# Altium schematic sheet Input Filter.SchDoc
size A4
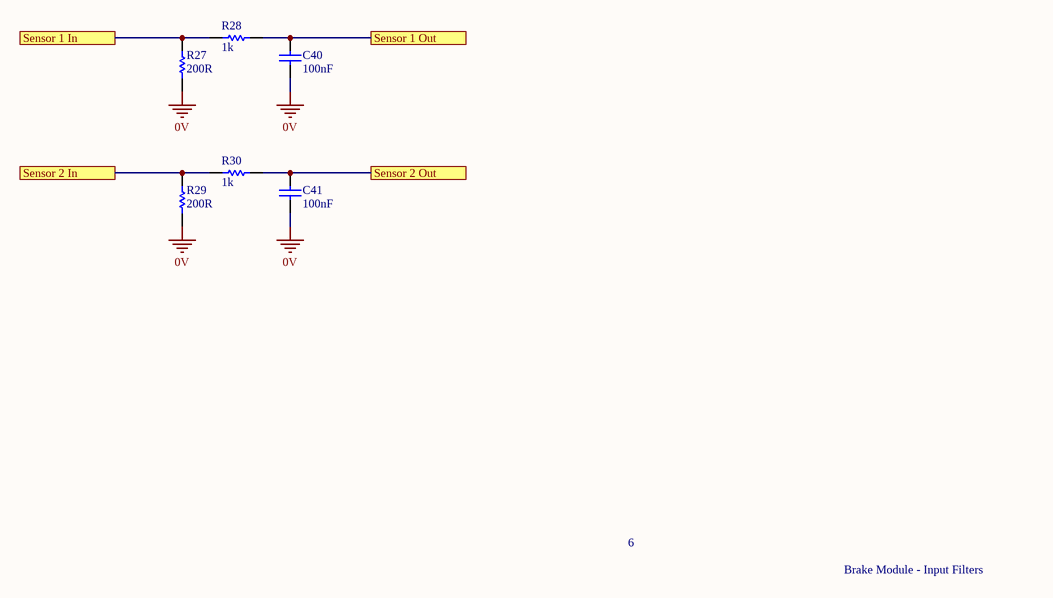
[diagram p0: Input Filter.SchDoc]

## Parts
C40  100nF  [0805]
C41  100nF  [0805]
R27  200R  [0805]
R28  1k  [0805]
R29  200R  [0805]
R30  1k  [0805]

## Ports
Sensor 1 In, Sensor 1 Out, Sensor 2 In, Sensor 2 Out

## Nets
0V: C40.1 C41.1 R27.1 R29.1
Sensor 1 In: R27.2 R28.1 ; port Sensor 1 In
Sensor 1 Out: C40.2 R28.2 ; port Sensor 1 Out
Sensor 2 In: R29.2 R30.1 ; port Sensor 2 In
Sensor 2 Out: C41.2 R30.2 ; port Sensor 2 Out

## Notes on the sheet
- 6
- Brake Module - Input Filters

## Library data of the parts
C40 C41 = GCM21BR71H104KA37L: Manufacturer: muRata; Tolerance: ±10%; Material: X7R; Rated Voltage: 50V; Part Number: GCM21BR71H104KA37L; Value: 100nF; Digikey Part Number: 490-6064-1-ND
R27 R29 = RC0805FR07200RL: Manufacturer: YAGEO; Tolerance: 0.01; Rated Voltage: 0.125W; Part Number: RC0805FR07200RL; Value: 200R; Material: FR-07; Digikey Part Number: 311-200CRCT-ND
R28 R30 = RC0805FR071KL: Manufacturer: YAGEO; Tolerance: 0.01; Rated Voltage: 0.125W; Part Number: RC0805FR071KL; Value: 1k; Material: FR-07; Digikey Part Number: 311-1.00KCRCT-ND